# Altium schematic sheet 3732_connectors.SchDoc
size A3; SheetNumber: 3; SheetTotal: 3
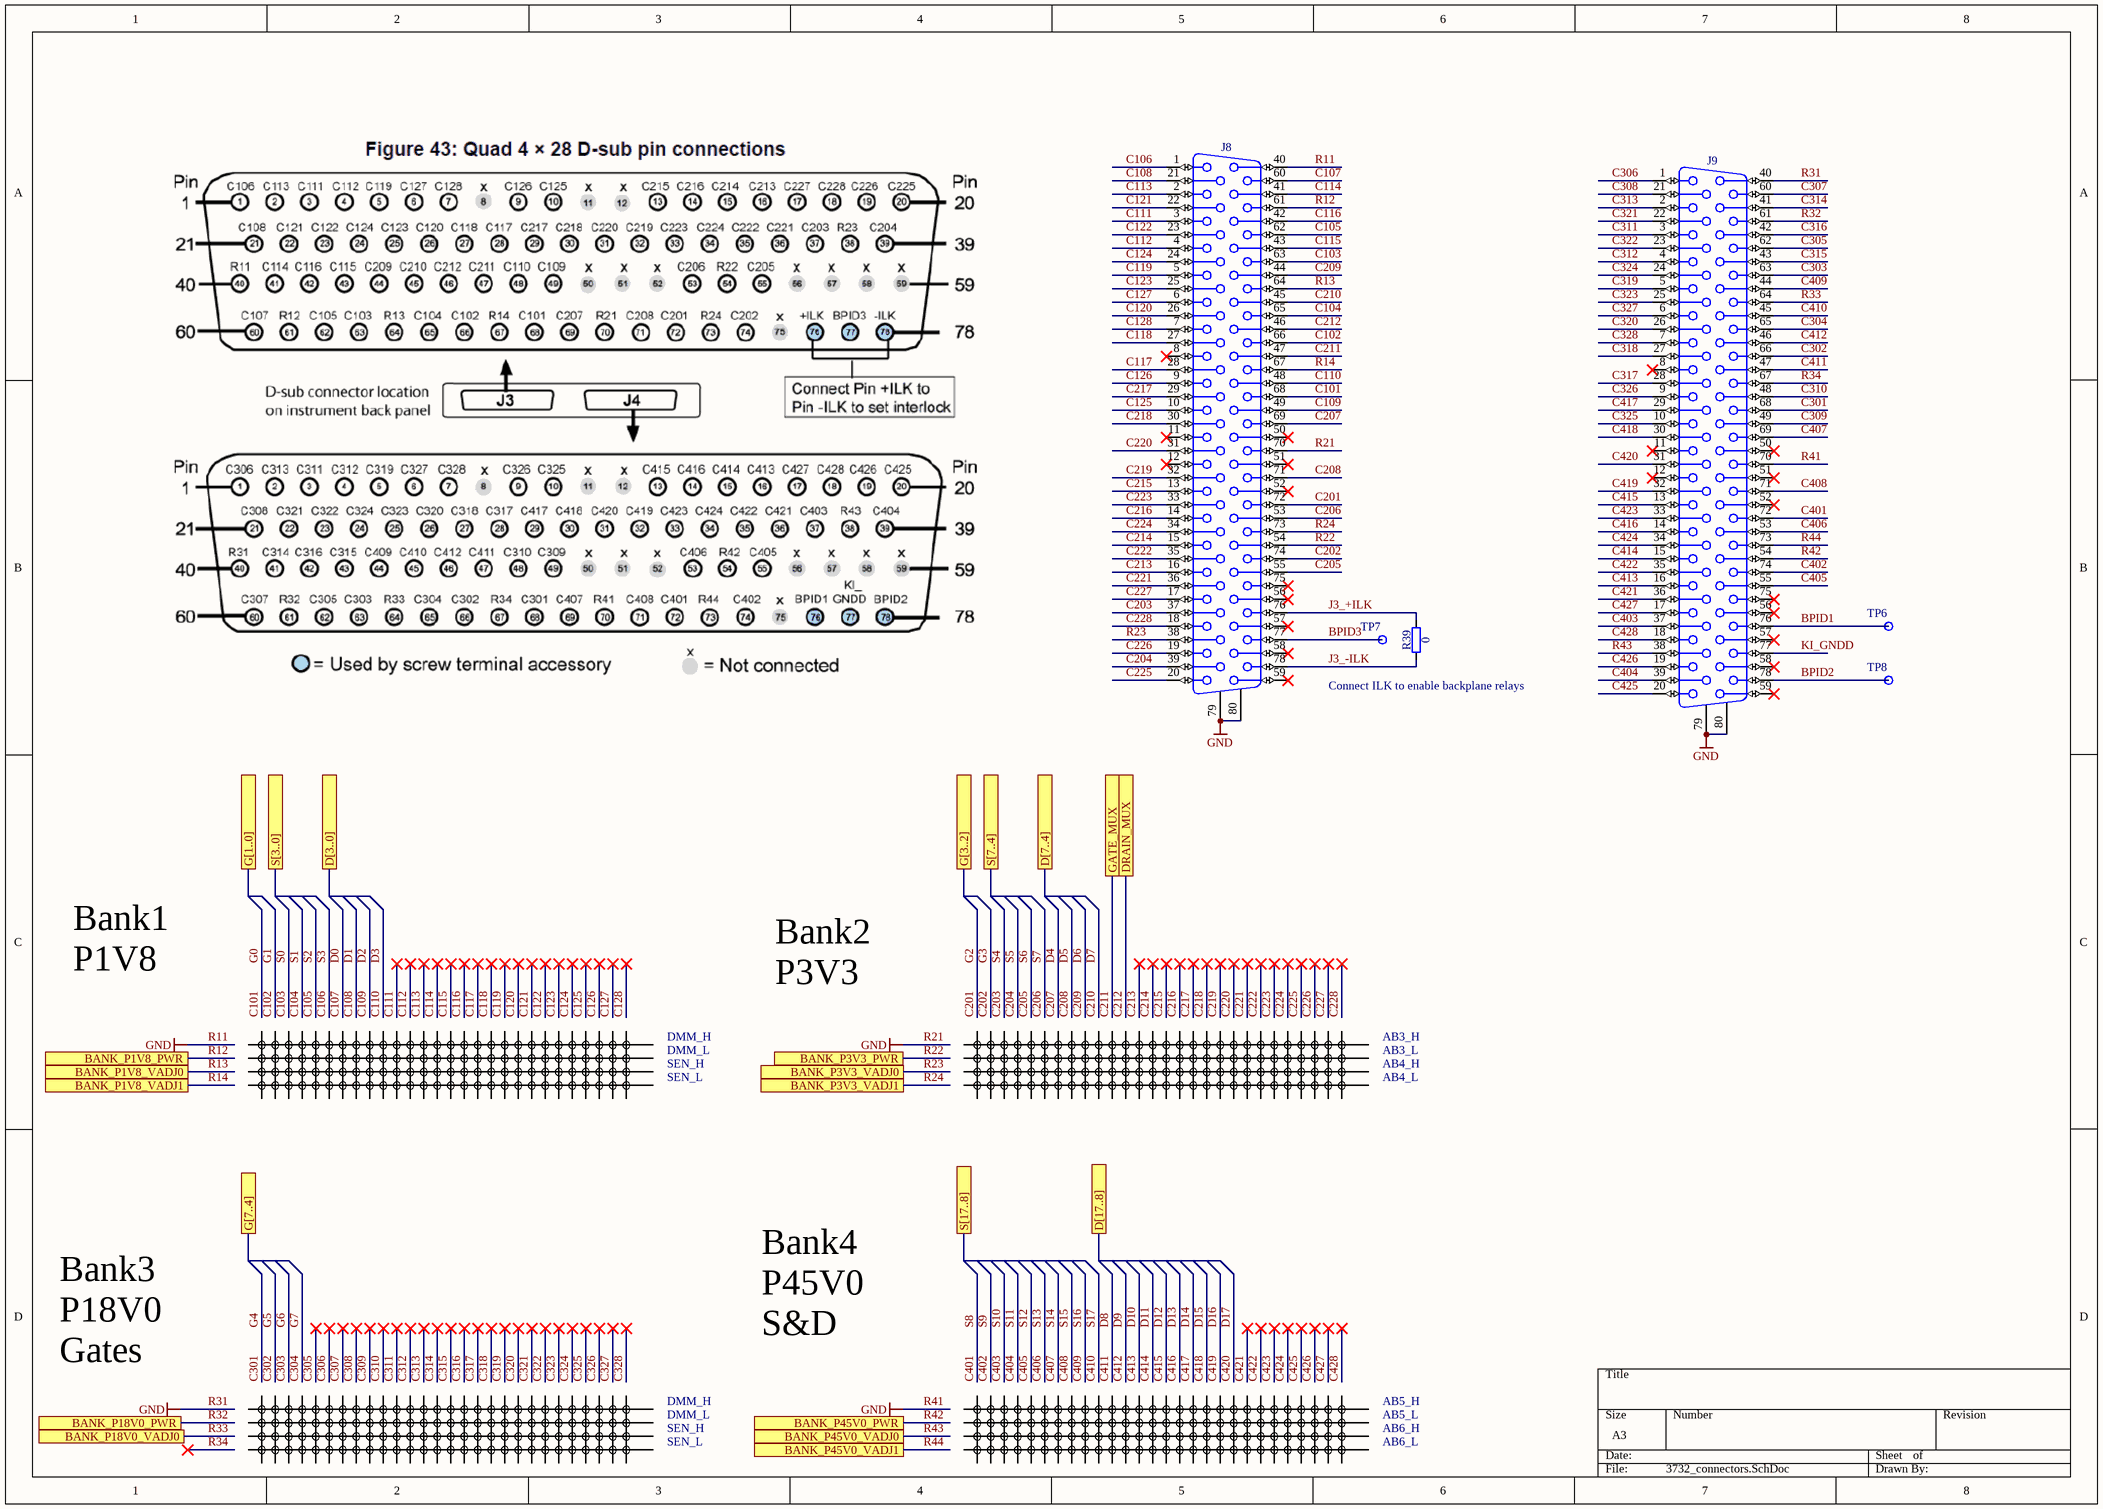
[diagram p0: 3732_connectors.SchDoc]

## Parts
J8  D-Sub 78F  [HARTING_09 56 551 7513]  (value not drawn)
J9  D-Sub 78F  [HARTING_09 56 551 7513]  (value not drawn)
R39  0  [RESC1005X40N]
TP6  Test Point  [TPS127]  (value not drawn)
TP7  Test Point  [TPS127]  (value not drawn)
TP8  Test Point  [TPS127]  (value not drawn)

## Ports
BANK_P1V8_PWR (see top[3B]), BANK_P1V8_VADJ0 (see top[3B], 3723_connectors[3A]), BANK_P1V8_VADJ1 (see top[3B], 3723_connectors[3A]), BANK_P3V3_PWR (see top[5B]), BANK_P3V3_VADJ0 (see top[5B], 3723_connectors[3A]), BANK_P3V3_VADJ1 (see top[5B], 3723_connectors[3A]), BANK_P18V0_PWR (see top[3B]), BANK_P18V0_VADJ0 (see top[3B]), BANK_P45V0_PWR (see top[5B]), BANK_P45V0_VADJ0 (see top[5B]), BANK_P45V0_VADJ1 (see top[5B]), D[3..0] (see top[3B]), D[7..4] (see top[5B]), D[17..8] (see top[5B]), DRAIN_MUX (see top[3B]), G[1..0] (see top[3B]), G[3..2] (see top[5B]), G[7..4] (see top[3B]), GATE_MUX (see top[3B]), S[3..0] (see top[3B]), S[7..4] (see top[5B]), S[17..8] (see top[5B])

## Nets
R11: J8.40 J8.70 J8.79 J8.80 J9.40 J9.70 J9.79 J9.80  [also labelled GND, R21, R31, R41]
BPID1: J9.76 TP6.1
BPID2: J9.78 TP8.1
BPID3: J8.77 TP7.1
C101: J8.68  [also labelled G0]
C102: J8.66  [also labelled G1]
C103: J8.63  [also labelled S0]
C104: J8.65  [also labelled S1]
C105: J8.62  [also labelled S2]
C106: J8.1  [also labelled S3]
C107: J8.60  [also labelled D0]
C108: J8.21  [also labelled D1]
C109: J8.49  [also labelled D2]
C110: J8.48  [also labelled D3]
C111: J8.3
C112: J8.4
C113: J8.2
C114: J8.41
C115: J8.43
C116: J8.42
C117: J8.28
C118: J8.27
C119: J8.5
C120: J8.26
C121: J8.22
C122: J8.23
C123: J8.25
C124: J8.24
C125: J8.10
C126: J8.9
C127: J8.6
C128: J8.7
C201: J8.72  [also labelled G2]
C202: J8.74  [also labelled G3]
C203: J8.37  [also labelled S4]
C204: J8.39  [also labelled S5]
C205: J8.55  [also labelled S6]
C206: J8.53  [also labelled S7]
C207: J8.69  [also labelled D4]
C208: J8.71  [also labelled D5]
C209: J8.44  [also labelled D6]
C210: J8.45  [also labelled D7]
C211: J8.47 ; port GATE_MUX
C212: J8.46 ; port DRAIN_MUX
C213: J8.16
C214: J8.15
C215: J8.13
C216: J8.14
C217: J8.29
C218: J8.30
C219: J8.32
C220: J8.31
C221: J8.36
C222: J8.35
C223: J8.33
C224: J8.34
C225: J8.20
C226: J8.19
C227: J8.17
C228: J8.18
C301: J9.68  [also labelled G4]
C302: J9.66  [also labelled G5]
C303: J9.63  [also labelled G6]
C304: J9.65  [also labelled G7]
C305: J9.62
C306: J9.1
C307: J9.60
C308: J9.21
C309: J9.49
C310: J9.48
C311: J9.3
C312: J9.4
C313: J9.2
C314: J9.41
C315: J9.43
C316: J9.42
C317: J9.28
C318: J9.27
C319: J9.5
C320: J9.26
C321: J9.22
C322: J9.23
C323: J9.25
C324: J9.24
C325: J9.10
C326: J9.9
C327: J9.6
C328: J9.7
C401: J9.72  [also labelled S8]
C402: J9.74  [also labelled S9]
C403: J9.37  [also labelled S10]
C404: J9.39  [also labelled S11]
C405: J9.55  [also labelled S12]
C406: J9.53  [also labelled S13]
C407: J9.69  [also labelled S14]
C408: J9.71  [also labelled S15]
C409: J9.44  [also labelled S16]
C410: J9.45  [also labelled S17]
C411: J9.47  [also labelled D8]
C412: J9.46  [also labelled D9]
C413: J9.16  [also labelled D10]
C414: J9.15  [also labelled D11]
C415: J9.13  [also labelled D12]
C416: J9.14  [also labelled D13]
C417: J9.29  [also labelled D14]
C418: J9.30  [also labelled D15]
C419: J9.32  [also labelled D16]
C420: J9.31  [also labelled D17]
C421: J9.36
C422: J9.35
C423: J9.33
C424: J9.34
C425: J9.20
C426: J9.19
C427: J9.17
C428: J9.18
J3_+ILK: J8.76 R39.2
J3_-ILK: J8.78 R39.1
KI_GNDD: J9.77
R12: J8.61 ; port BANK_P1V8_PWR
R13: J8.64 ; port BANK_P1V8_VADJ0
R14: J8.67 ; port BANK_P1V8_VADJ1
R22: J8.54 ; port BANK_P3V3_PWR
R23: J8.38 ; port BANK_P3V3_VADJ0
R24: J8.73 ; port BANK_P3V3_VADJ1
R32: J9.61 ; port BANK_P18V0_PWR
R33: J9.64 ; port BANK_P18V0_VADJ0
R34: J9.67
R42: J9.54 ; port BANK_P45V0_PWR
R43: J9.38 ; port BANK_P45V0_VADJ0
R44: J9.73 ; port BANK_P45V0_VADJ1

Not connected (* = marked no-connect by the designer): J8 8* 11* 12* 50* 51* 52* 56* 57* 58* 59* 75*; J9 8* 11* 12* 50* 51* 52* 56* 57* 58* 59* 75*

## Notes on the sheet
- Connect ILK to enable backplane relays
- Bank1
  P1V8
- DMM_H
- DMM_L
- Bank2
  P3V3
- AB3_H
- AB3_L
- SEN_H
- SEN_L
- AB4_H
- AB4_L
- Bank3
  P18V0
  Gates
- Bank4
  P45V0
  S&D
- AB5_H
- AB5_L
- AB6_H
- AB6_L

## Library data of the parts
J8 J9 = HARTING_09 56 551 7513: Connector D-sub 78 Female; Part Description: High Density Straight Female D-SUB 78 Contacts, with Grounding Board Locks and Female Screw Lock 4-40; PressFit: No; Part Number: HARTING_09 56 551 7513; Component Kind: Standard; Component Type: Standard; Pin Count: 80; Family: D-Sub 78F; Mounted: Yes; Socket: No; SMD: No; Sense: No; Status: None; Manufacturer: HARTING; Manufacturer Part Number: 09 56 551 7513; ComponentHeight: 12.7mm; HelpURL: \\cern.ch\dfs\Applications\Altium\Datasheets\HARTING_09 56 551 7513.pdf; Author: CERN DEM JLC; CreateDate: 15.12.2014; LatestRevisionDate: 15.12.2014
R39 = R0402_0R_JUMPER: Resistor; Part Description: 1A (0.05R Max DC Resistance) Zero Ohm Jumper; Manufacturer: GENERIC; Manufacturer1 Part Number: 232270591001L; PressFit: No; Part Number: R0402_0R_JUMPER; Component Kind: Standard; Component Type: Standard; Pin Count: 2; Value: 0; Status: Not Recommended; Manufacturer Part Number: R0402_0R_JUMPER; Case: 0402; Mounted: Yes; Sense: No; Socket: No; SMD: Yes; Manufacturer1 Example: YAGEO PHYCOMP; Manufacturer1 ComponentHeight: 0.4mm; HelpURL: \\cern.ch\dfs\Applications\Altium\Datasheets\R0402_Phycomp_RC0402.pdf; Author: CERN DEM JLC; CreateDate: 03.12.2007; LatestRevisionDate: 17.10.2012
TP6-TP8 = SMD_PAD_1.27X1.27MM: Part Description: 1.27mm x 1.27mm PCB Copper Area (SMD Test Point); Mounted: No; Part Number: SMD_PAD_1.27X1.27MM; Component Kind: Standard (No BOM); Component Type: Standard (No BOM); Pin Count: 1; Family: Test Point; Socket: No; SMD: No; Sense: No; Status: None; ComponentHeight: 0mm; HelpURL: Undefined; Author: CERN DEM JLC; CreateDate: 12.01.2008; LatestRevisionDate: 12.01.2008; PackageDescription: 1.27mm x 1.27mm PCB Copper Area (SMD Test Point)